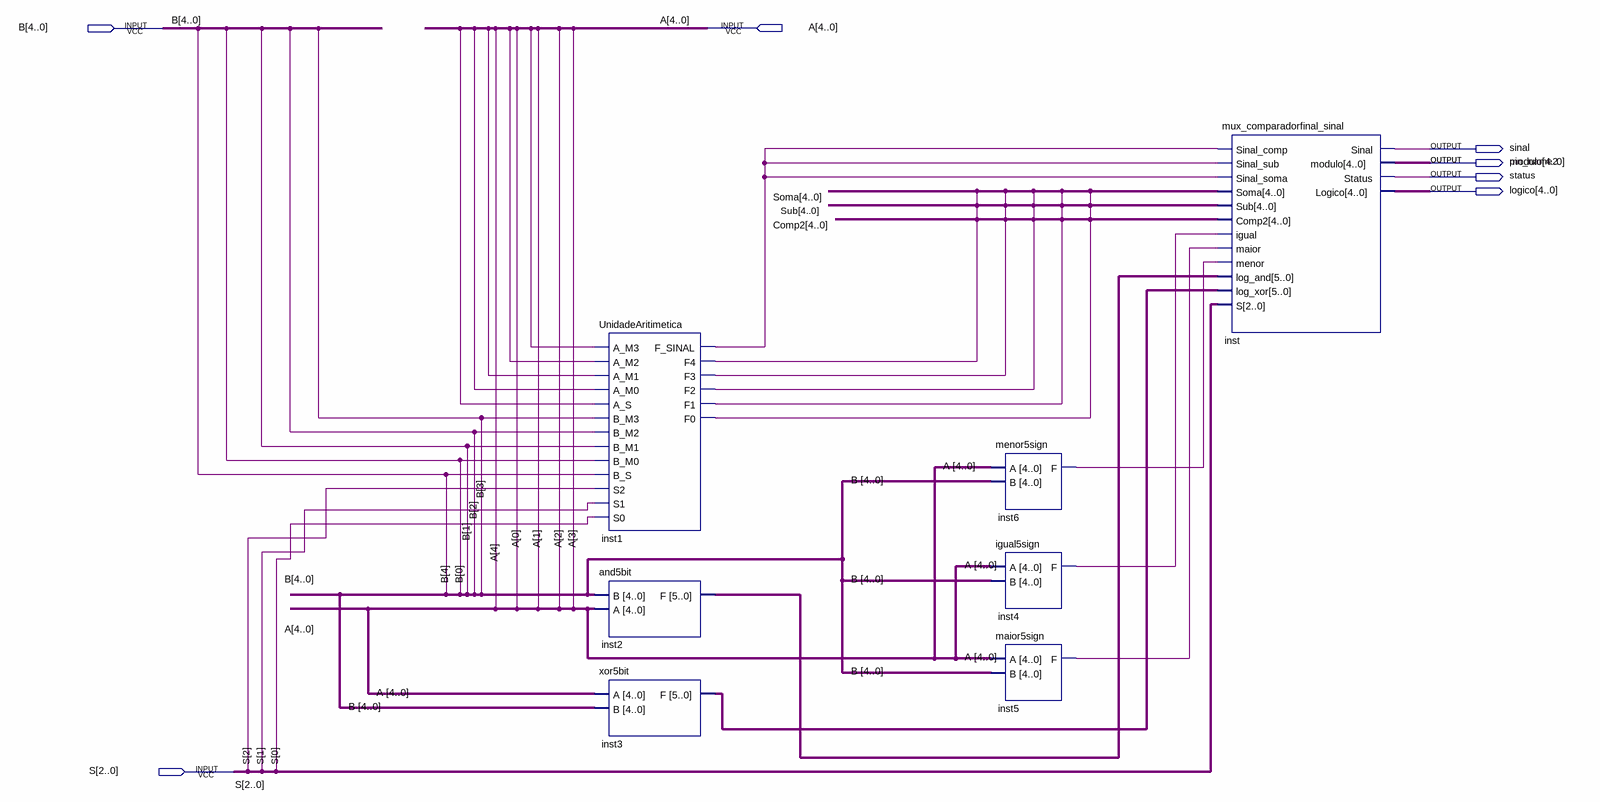
[diagram p0: schematic sheet]
// Quartus schematic projetosd.bdf as structural Verilog: 7 symbols, 8 pins
module projetosd (
  input  [4:0] B,
  input  [4:0] A,
  input  [2:0] S,
  output sinal,
  output pin_name2,
  output [4:0] modulo,
  output status,
  output [4:0] logico
);

  wire inst1_f_sinal, inst4_f, inst5_f, inst6_f, undriven, undriven_2;
  wire [4:0] Comp2, Soma, Sub;
  wire [5:0] log_and, log_xor;

  UnidadeAritimetica inst1 (
    .A_M3(A[3]), .A_M2(A[2]), .A_M1(A[1]), .A_M0(undriven), .A_S(undriven_2), .B_M3(B[3]), .B_M2(B[2]),
    .B_M1(B[1]), .B_M0(B[0]), .B_S(B[4]), .S2(S[2]), .S1(S[1]), .S0(S[0]), .F_SINAL(inst1_f_sinal),
    .F4(Comp2[4]), .F3(Comp2[3]), .F2(Comp2[2]), .F1(Comp2[1]), .F0(Comp2[0]));
  and5bit inst2 (.B(B), .A(A), .F(log_and));
  xor5bit inst3 (.A(A), .B(B), .F(log_xor));
  menor5sign inst6 (.A(A), .B(B), .F(inst6_f));
  igual5sign inst4 (.A(A), .B(B), .F(inst4_f));
  maior5sign inst5 (.A(A), .B(B), .F(inst5_f));
  mux_comparadorfinal_sinal inst (
    .Sinal_comp(inst1_f_sinal), .Sinal_sub(inst1_f_sinal), .Sinal_soma(inst1_f_sinal), .Soma(Soma),
    .Sub(Sub), .Comp2(Comp2), .igual(inst4_f), .maior(inst5_f), .menor(inst6_f), .log_and(log_and),
    .log_xor(log_xor), .S(S), .Sinal(sinal), .modulo(modulo), .Status(status), .Logico(logico));
endmodule
